# EasyEDA schematic SCH_DC.json
TITLE: Sheet_1; REV: 1.0; Date: 2025-03-23; Sheet: 1/1; Drawn By: alejobsmith; Company: Your Company
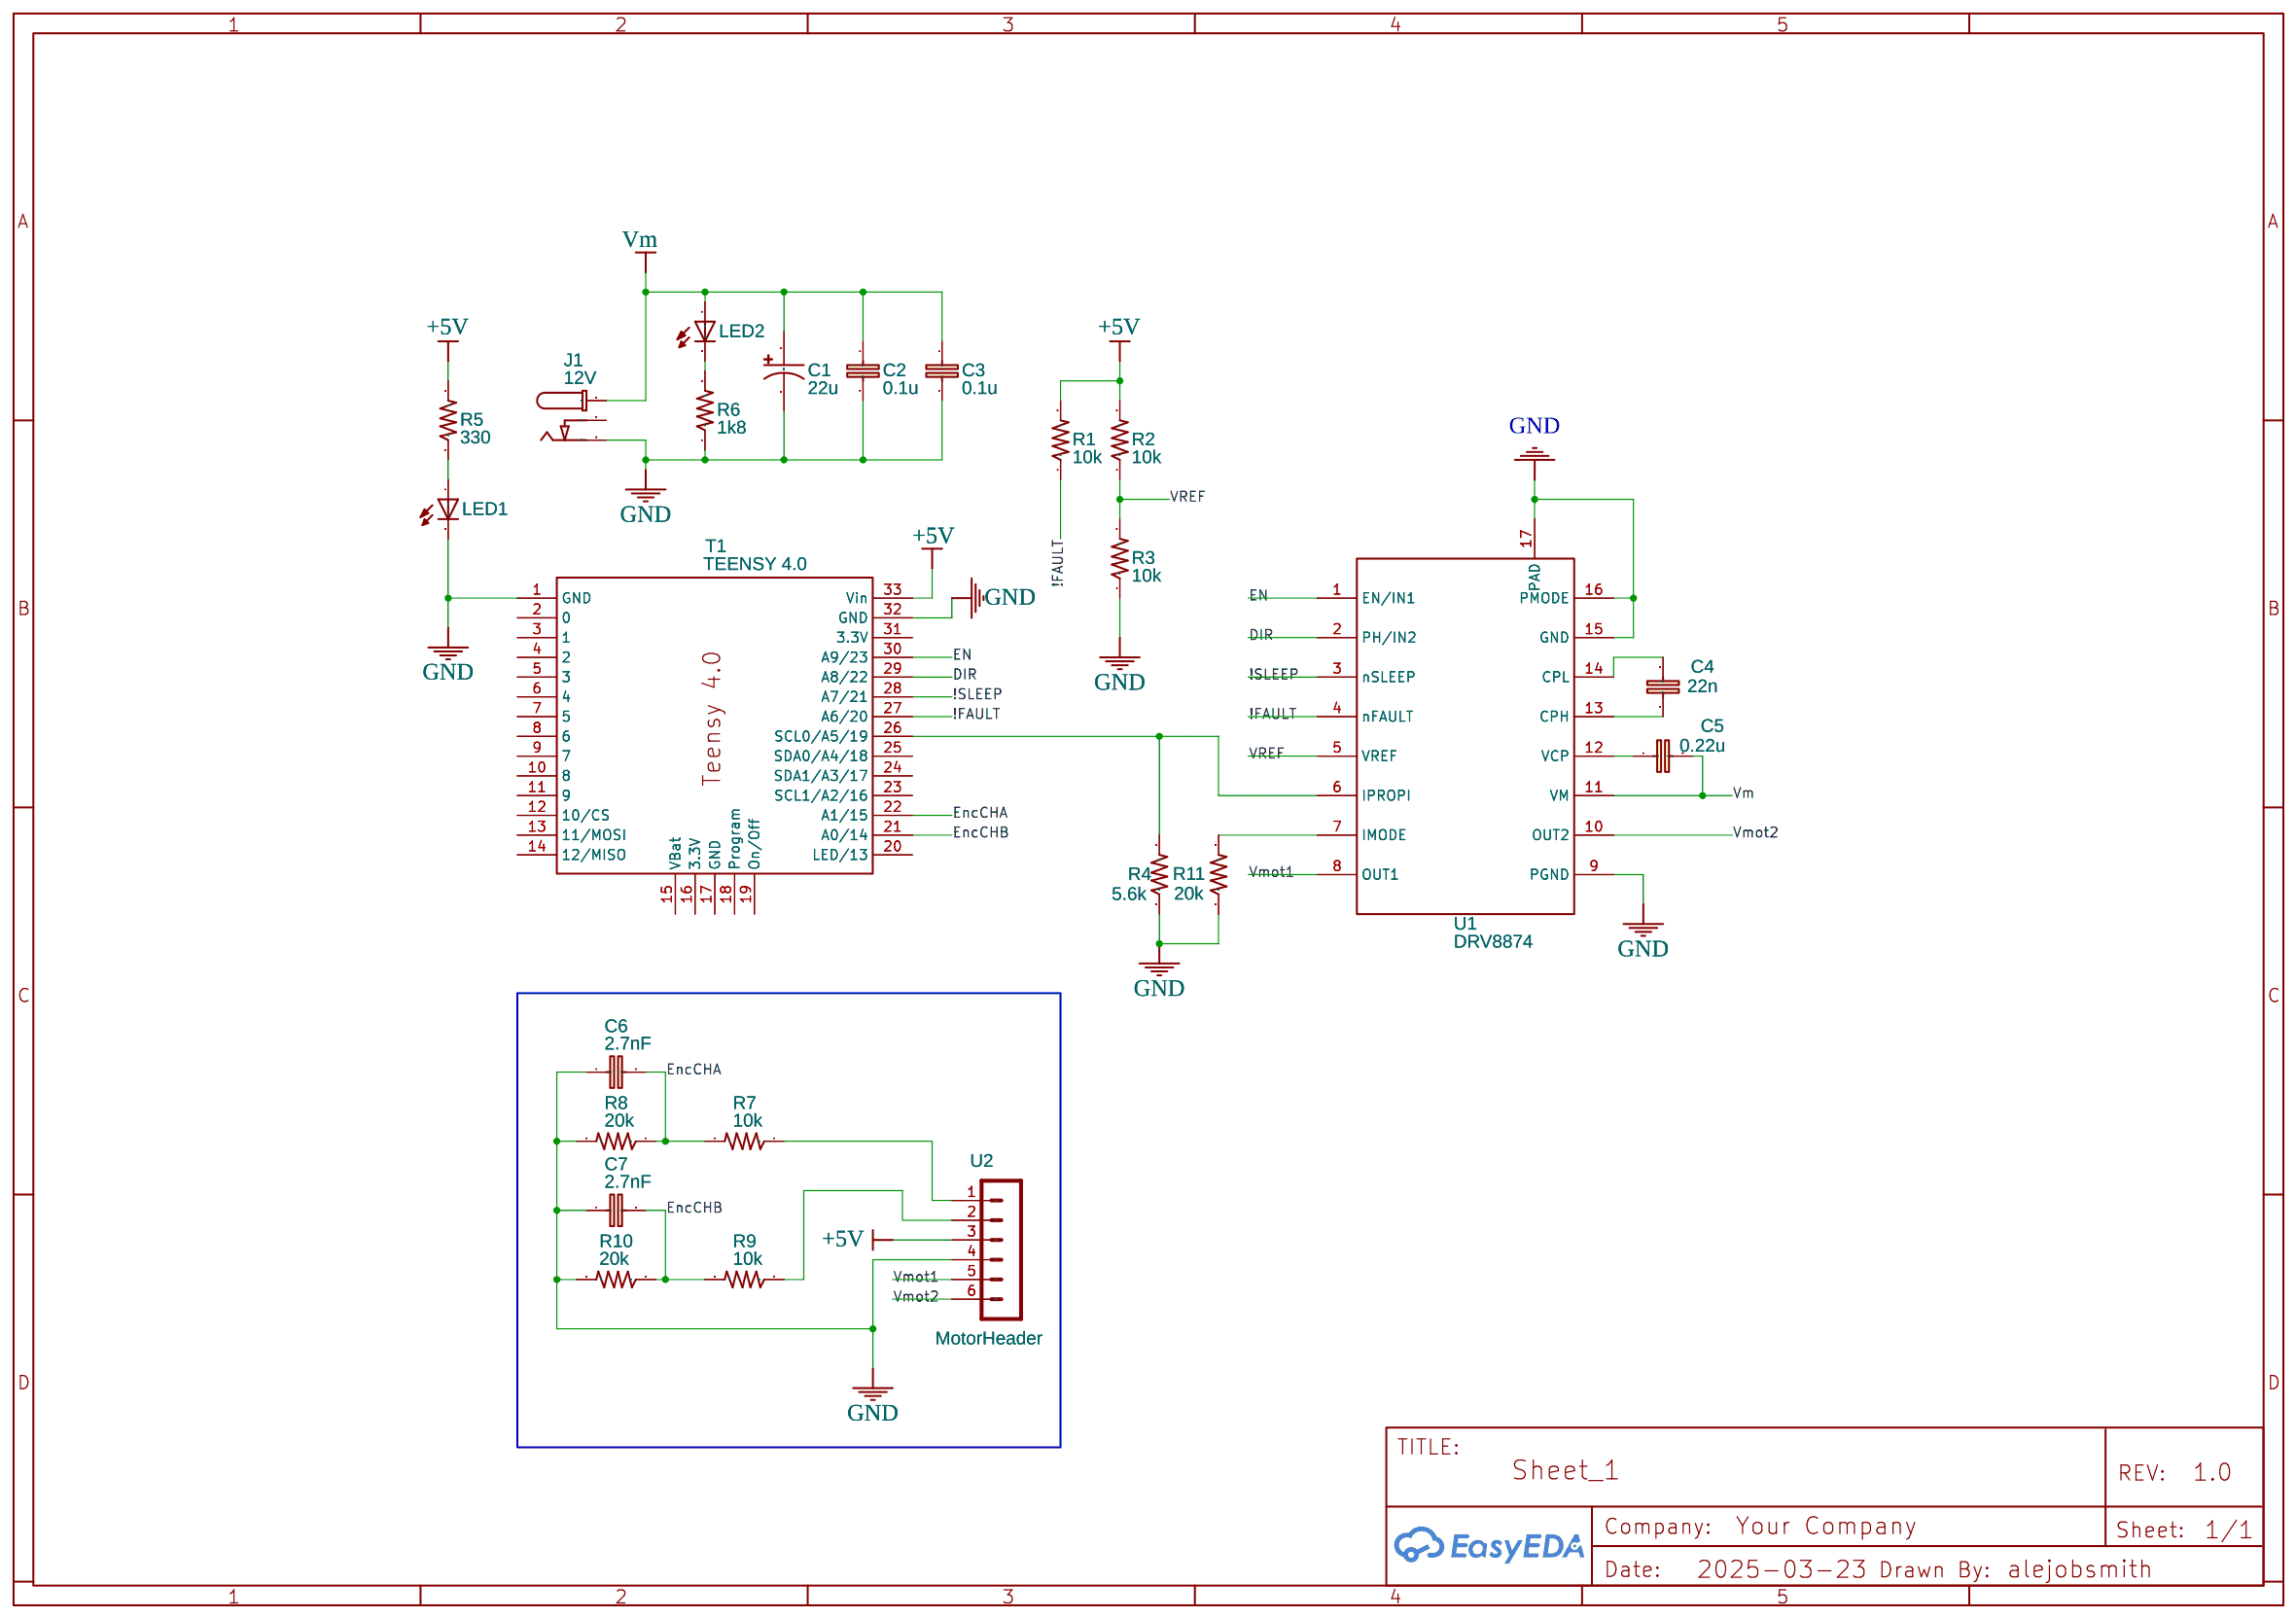
[diagram p0: schematic sheet]

## Parts
C1  22u  [CAP-5*11]
C2  0.1u  [CAP_RAD-2.5MM]
C3  0.1u  [CAP_RAD-2.5MM]
C4  22n  [CAP_RAD-2.5MM]
C5  0.22u  [CAP_RAD-2.5MM]
C6  2.7nF  [CAP_RAD-2.5MM]
C7  2.7nF  [CAP_RAD-2.5MM]
J1  12V  [DC_BARREL_JACK_PTH_2MM_2]
LED1  LED_5MM  [LED-5MM-5MM]
LED2  LED_5MM  [LED-5MM-5MM]
R1  10k  [RD-6X2.5-1/4W]
R2  10k  [RD-6X2.5-1/4W]
R3  10k  [RD-6X2.5-1/4W]
R4  5.6k  [RD-6X2.5-1/4W]
R5  330  [RD-6X2.5-1/4W]
R6  1k8  [RD-6X2.5-1/4W]
R7  10k  [RD-6X2.5-1/4W]
R8  20k  [RD-6X2.5-1/4W]
R9  10k  [RD-6X2.5-1/4W]
R10  20k  [RD-6X2.5-1/4W]
R11  20k  [RD-6X2.5-1/4W]
T1  TEENSY 4.0  [TEENSY4.0]
U1  DRV8874  [DRV8874 FOOTPRINT]
U2  MotorHeader  [06X1-PTH]

## Library data of the parts
C1 = Cap_Electrolytic(SMD)_D5.0XH5.5_US
C2-C7 = CAPACITOR_NPOL-1206: Non-Polarized capacitor in various packages; Contributor: DangerousPrototype
J1 = CON_DC_M-DC_PTH2: DC power connector; Contributor: DangerousPrototype
LED1 LED2 = LED_5MM: Contributor: Airtau
R1-R11 = R-US_R1206: RESISTOR, American symbol; Contributor: Adafruit
T1 = TEENSY 4.0: Manufacturer: PJRC; Supplier: PJRC; link: https://www.pjrc.com/store/teensy40.html; Contributor: pratchayapon
U1 = DRV8874: Manufacturer: Texas Instruments; Supplier: TI; link: https://www.ti.com/product/DRV8874; Contributor: Plexus
U2 = HEADER-06X1-MALE: 6 x 0.1 inch Header; Contributor: SparkFun

## Nets
+5V: R1.2 R2.2 R5.2 T1.33(Vin) U2.3
GND: C1.2 C2.2 C3.2 C6.1 C7.1 J1.P3(P2) LED1.2(C) R3.1 R4.1 R6.1 R8.2 R10.2 R11.1 T1.1(GND) T1.32(GND) U1.9(PGND) U1.15(GND) U1.16(PMODE) U1.17(PAD) U2.4
!FAULT: R1.1 T1.27(A6/20) U1.4(nFAULT)
!SLEEP: T1.28(A7/21) U1.3(nSLEEP)
DIR: T1.29(A8/22) U1.2(PH/IN2)
EN: T1.30(A9/23) U1.1(EN/IN1)
EncCHA: C6.2 R7.2 R8.1 T1.22(A1/15)
EncCHB: C7.2 R9.2 R10.1 T1.21(A0/14)
Vm: C1.1 C2.1 C3.1 C5.2 J1.P1 LED2.1(A) U1.11(VM)
Vmot1: U1.8(OUT1) U2.5
Vmot2: U1.10(OUT2) U2.6
VREF: R2.1 R3.2 U1.5(VREF)
Net-(C4-1): C4.1 U1.13(CPH)
Net-(C4-2): C4.2 U1.14(CPL)
Net-(C5-1): C5.1 U1.12(VCP)
Net-(LED1-1): LED1.1(A) R5.1
Net-(LED2-2): LED2.2(C) R6.2
Net-(R4-2): R4.2 T1.26(SCL0/A5/19) U1.6(IPROPI)
Net-(R7-1): R7.1 U2.1
Net-(R9-1): R9.1 U2.2
Net-(R11-2): R11.2 U1.7(IMODE)

Not connected (* = marked no-connect by the designer): J1 P2(P3); T1 2(0) 3(1) 4(2) 5(3) 6(4) 7(5) 8(6) 9(7) 10(8) 11(9) 12(10/CS) 13(11/MOSI) 14(12/MISO) 15(VBat) 16(3.3V) 17(GND) 18(Program) 19(On/Off) 20(LED/13) 23(SCL1/A2/16) 24(SDA1/A3/17) 25(SDA0/A4/18) 31(3.3V)
